# EAGLE design LED Controller (EAGLE 9.5.1)
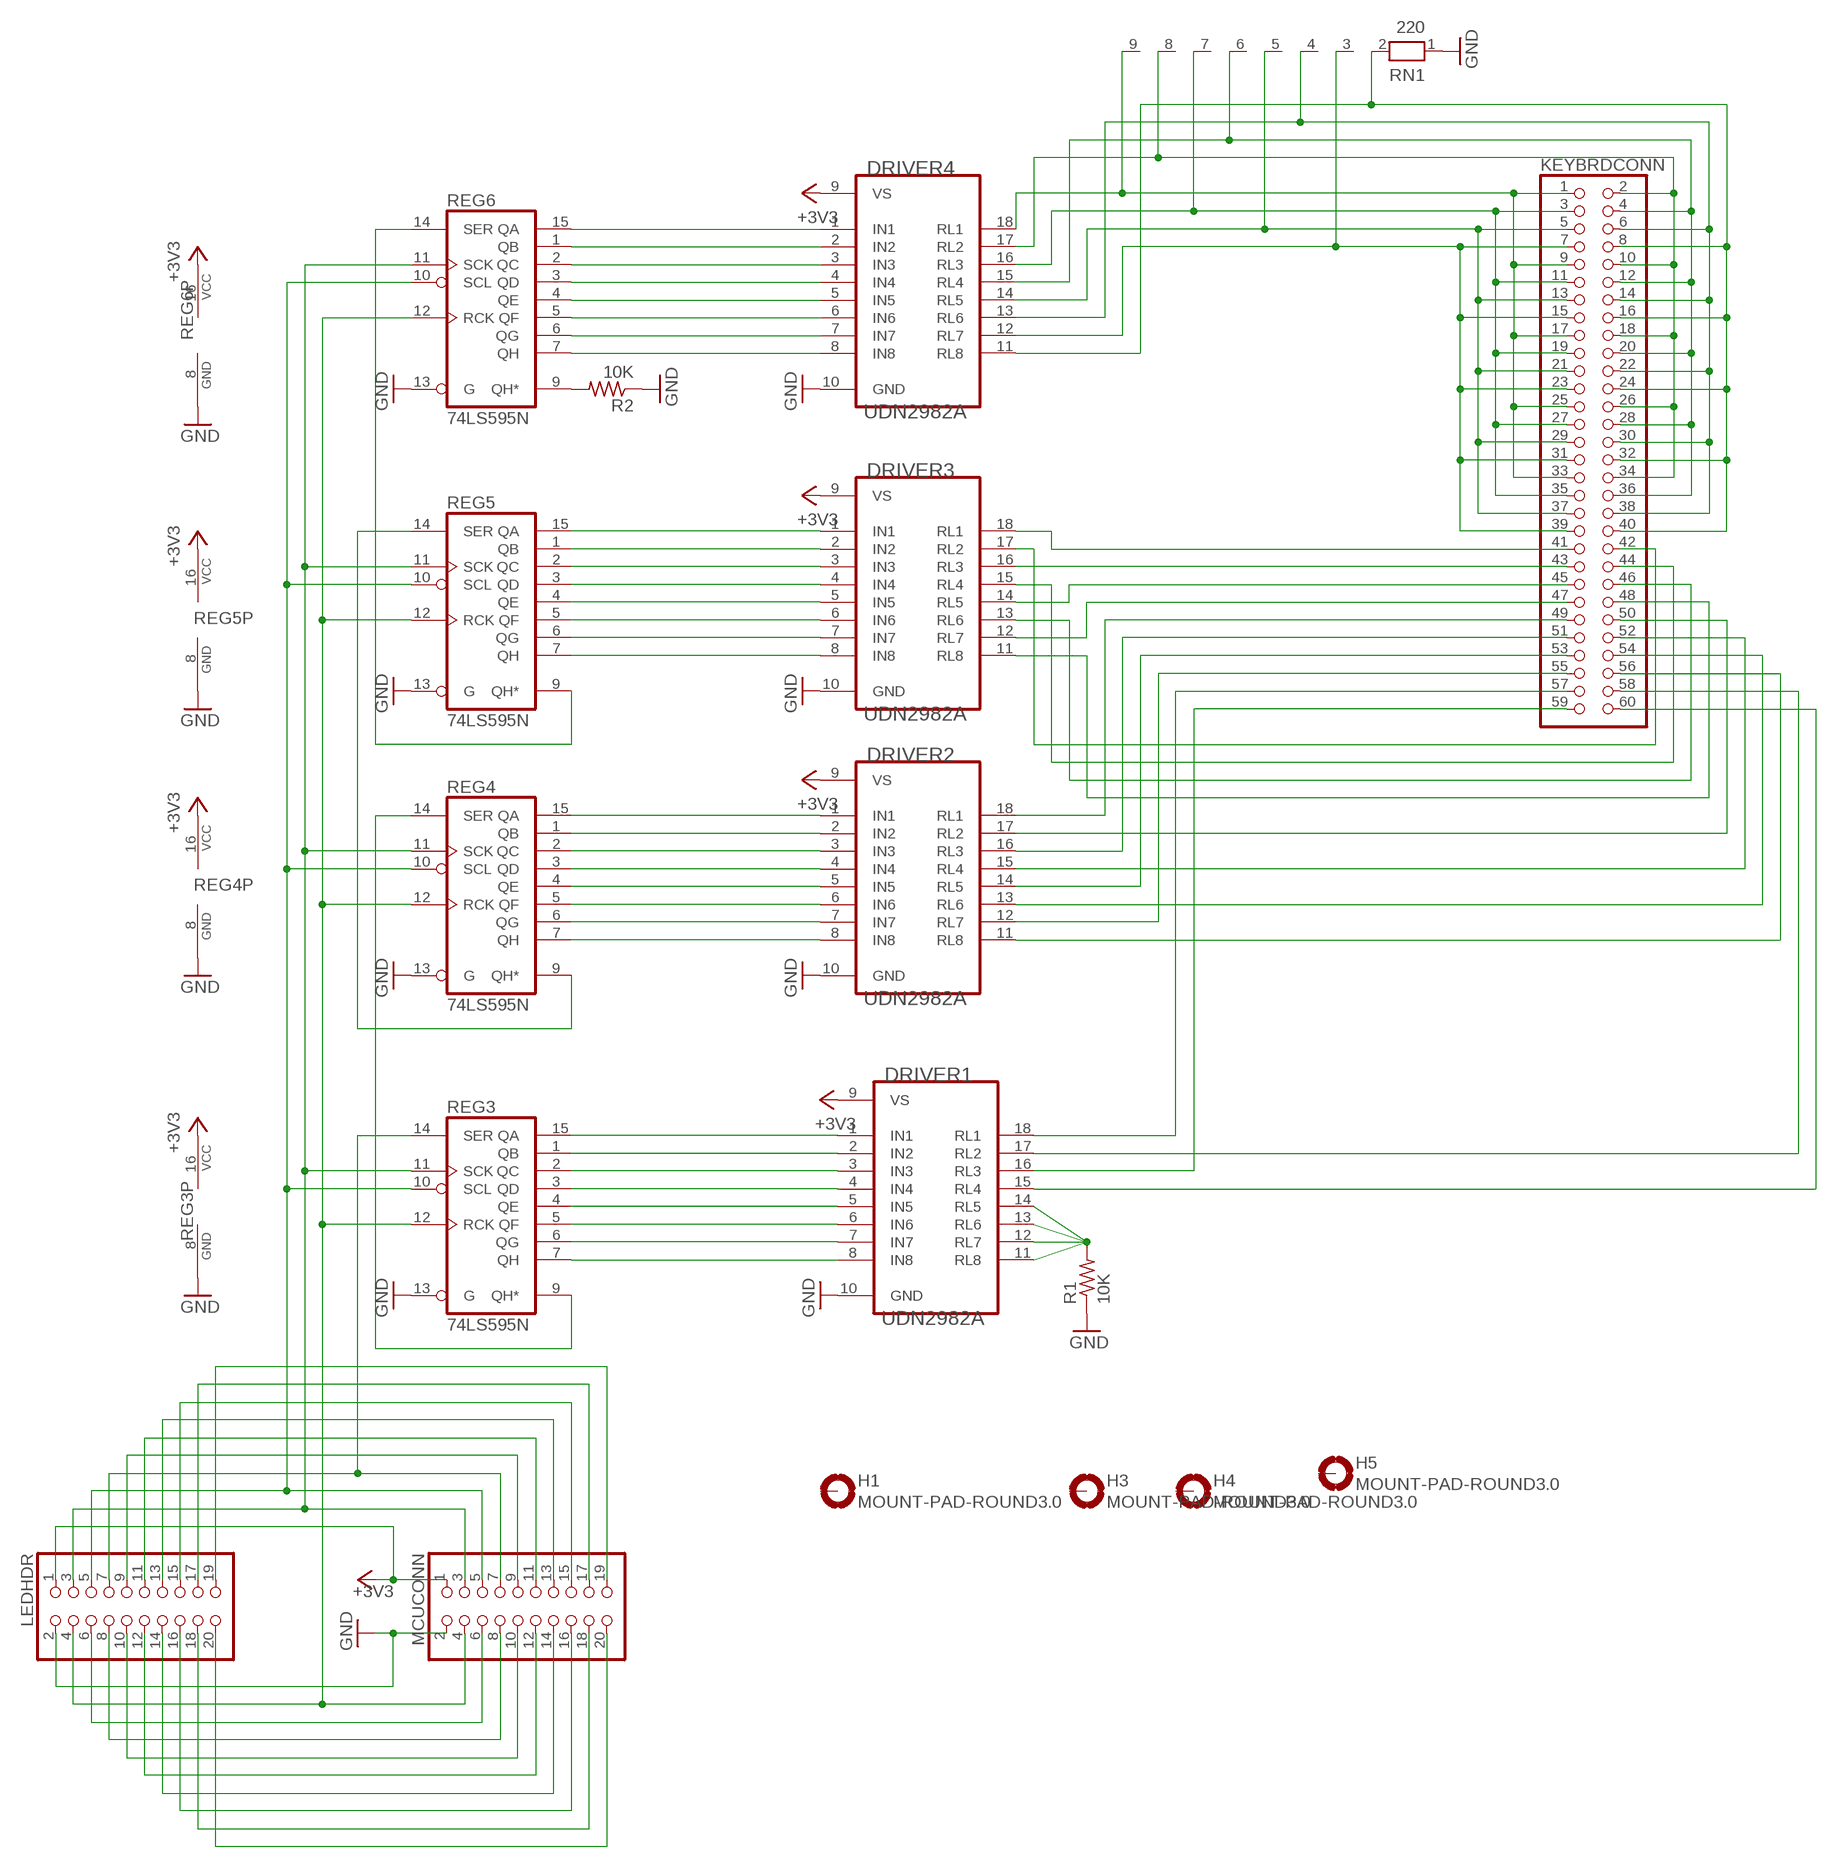
[diagram p0: schematic, sheet 1]

## Parts
DRIVER1  UDN2982A  [DIL18]
DRIVER2  UDN2982A  [DIL18]
DRIVER3  UDN2982A  [DIL18]
DRIVER4  UDN2982A  [DIL18]
H1  MOUNT-PAD-ROUND3.0  [3,0-PAD]
H3  MOUNT-PAD-ROUND3.0  [3,0-PAD]
H4  MOUNT-PAD-ROUND3.0  [3,0-PAD]
H5  MOUNT-PAD-ROUND3.0  [3,0-PAD]
KEYBRDCONN  PINHD-2X30/90  [2X30/90]
LEDHDR  PINHD-2X10  [2X10]
MCUCONN  PINHD-2X10  [2X10]
R1  10K  R-US_VMTA55  [VMTA55]
R2  10K  R-US_VMTA55  [VMTA55]
REG3  74LS595N  [DIL16]
REG4  74LS595N  [DIL16]
REG5  74LS595N  [DIL16]
REG6  74LS595N  [DIL16]
RN1  220  RN08  [RN-9]

## Nets
+3V3: DRIVER1.9(VS) DRIVER2.9(VS) DRIVER3.9(VS) DRIVER4.9(VS) LEDHDR.1 MCUCONN.1 REG3.16(VCC) REG4.16(VCC) REG5.16(VCC) REG6.16(VCC)
GND: DRIVER1.10(GND) DRIVER2.10(GND) DRIVER3.10(GND) DRIVER4.10(GND) R1.1 R2.1 REG3.8(GND) REG3.13(G) REG4.8(GND) REG4.13(G) REG5.8(GND) REG5.13(G) REG6.8(GND) REG6.13(G) RN1.1
INHD: LEDHDR.6 MCUCONN.6
N$1: DRIVER1.8(IN8) REG3.7(QH)
N$2: DRIVER4.2(IN2) REG6.1(QB)
N$3: DRIVER4.3(IN3) REG6.2(QC)
N$4: LEDHDR.8 MCUCONN.8
N$5: LEDHDR.10 MCUCONN.10
N$6: LEDHDR.12 MCUCONN.12
N$7: LEDHDR.14 MCUCONN.14
N$8: LEDHDR.16 MCUCONN.16
N$9: LEDHDR.18 MCUCONN.18
N$10: LEDHDR.20 MCUCONN.20
N$11: DRIVER4.4(IN4) REG6.3(QD)
N$12: DRIVER1.1(IN1) REG3.15(QA)
N$13: REG3.9(QH*) REG4.14(SER)
N$14: LEDHDR.9 MCUCONN.9
N$15: LEDHDR.11 MCUCONN.11
N$16: LEDHDR.13 MCUCONN.13
N$17: LEDHDR.15 MCUCONN.15
N$18: LEDHDR.17 MCUCONN.17
N$19: LEDHDR.19 MCUCONN.19
N$20: DRIVER4.11(RL8) KEYBRDCONN.8 KEYBRDCONN.16 KEYBRDCONN.24 KEYBRDCONN.32 KEYBRDCONN.40 RN1.2
N$21: DRIVER4.13(RL6) KEYBRDCONN.6 KEYBRDCONN.14 KEYBRDCONN.22 KEYBRDCONN.30 KEYBRDCONN.38 RN1.4
N$22: DRIVER4.15(RL4) KEYBRDCONN.4 KEYBRDCONN.12 KEYBRDCONN.20 KEYBRDCONN.28 KEYBRDCONN.36 RN1.6
N$23: DRIVER4.17(RL2) KEYBRDCONN.2 KEYBRDCONN.10 KEYBRDCONN.18 KEYBRDCONN.26 KEYBRDCONN.34 RN1.8
N$24: DRIVER1.2(IN2) REG3.1(QB)
N$25: DRIVER4.18(RL1) KEYBRDCONN.1 KEYBRDCONN.9 KEYBRDCONN.17 KEYBRDCONN.25 KEYBRDCONN.33 RN1.9
N$26: DRIVER1.3(IN3) REG3.2(QC)
N$27: DRIVER4.5(IN5) REG6.4(QE)
N$28: DRIVER4.6(IN6) REG6.5(QF)
N$29: DRIVER4.7(IN7) REG6.6(QG)
N$30: DRIVER1.4(IN4) REG3.3(QD)
N$31: DRIVER4.16(RL3) KEYBRDCONN.3 KEYBRDCONN.11 KEYBRDCONN.19 KEYBRDCONN.27 KEYBRDCONN.35 RN1.7
N$32: DRIVER4.14(RL5) KEYBRDCONN.5 KEYBRDCONN.13 KEYBRDCONN.21 KEYBRDCONN.29 KEYBRDCONN.37 RN1.5
N$33: DRIVER4.12(RL7) KEYBRDCONN.7 KEYBRDCONN.15 KEYBRDCONN.23 KEYBRDCONN.31 KEYBRDCONN.39 RN1.3
N$34: DRIVER1.5(IN5) REG3.4(QE)
N$35: DRIVER1.6(IN6) REG3.5(QF)
N$36: DRIVER1.7(IN7) REG3.6(QG)
N$37: REG4.9(QH*) REG5.14(SER)
N$38: REG5.9(QH*) REG6.14(SER)
N$39: DRIVER4.8(IN8) REG6.7(QH)
N$40: DRIVER4.1(IN1) REG6.15(QA)
N$41: R2.2 REG6.9(QH*)
N$42: DRIVER2.1(IN1) REG4.15(QA)
N$43: DRIVER2.2(IN2) REG4.1(QB)
N$44: DRIVER2.3(IN3) REG4.2(QC)
N$45: DRIVER2.4(IN4) REG4.3(QD)
N$46: DRIVER2.5(IN5) REG4.4(QE)
N$47: DRIVER2.6(IN6) REG4.5(QF)
N$48: DRIVER2.7(IN7) REG4.6(QG)
N$49: DRIVER2.8(IN8) REG4.7(QH)
N$50: DRIVER3.1(IN1) REG5.15(QA)
N$51: DRIVER3.2(IN2) REG5.1(QB)
N$52: DRIVER3.3(IN3) REG5.2(QC)
N$53: DRIVER3.4(IN4) REG5.3(QD)
N$54: DRIVER3.5(IN5) REG5.4(QE)
N$55: DRIVER3.6(IN6) REG5.5(QF)
N$56: DRIVER3.7(IN7) REG5.6(QG)
N$57: DRIVER3.8(IN8) REG5.7(QH)
N$58: DRIVER3.18(RL1) KEYBRDCONN.41
N$59: DRIVER3.16(RL3) KEYBRDCONN.43
N$60: DRIVER3.14(RL5) KEYBRDCONN.45
N$61: DRIVER3.12(RL7) KEYBRDCONN.47
N$62: DRIVER3.17(RL2) KEYBRDCONN.42
N$63: DRIVER3.15(RL4) KEYBRDCONN.44
N$64: DRIVER3.13(RL6) KEYBRDCONN.46
N$65: DRIVER3.11(RL8) KEYBRDCONN.48
N$66: DRIVER2.18(RL1) KEYBRDCONN.49
N$67: DRIVER2.16(RL3) KEYBRDCONN.51
N$68: DRIVER2.14(RL5) KEYBRDCONN.53
N$69: DRIVER1.18(RL1) KEYBRDCONN.57
N$70: DRIVER2.12(RL7) KEYBRDCONN.55
N$71: DRIVER2.17(RL2) KEYBRDCONN.50
N$72: DRIVER2.15(RL4) KEYBRDCONN.52
N$73: DRIVER2.13(RL6) KEYBRDCONN.54
N$74: DRIVER2.11(RL8) KEYBRDCONN.56
N$75: DRIVER1.16(RL3) KEYBRDCONN.59
N$76: DRIVER1.17(RL2) KEYBRDCONN.58
N$77: DRIVER1.15(RL4) KEYBRDCONN.60
N$81: DRIVER1.11(RL8) DRIVER1.12(RL7) DRIVER1.13(RL6) DRIVER1.14(RL5) R1.2
RCK: LEDHDR.4 MCUCONN.4 REG3.12(RCK) REG4.12(RCK) REG5.12(RCK) REG6.12(RCK)
REG3: LEDHDR.2 MCUCONN.2 ; supply symbol labelled GND
REG3DATA: LEDHDR.7 MCUCONN.7 REG3.14(SER)
SCK: LEDHDR.3 MCUCONN.3 REG3.11(SCK) REG4.11(SCK) REG5.11(SCK) REG6.11(SCK)
SCL: LEDHDR.5 MCUCONN.5 REG3.10(SCL) REG4.10(SCL) REG5.10(SCL) REG6.10(SCL)
Unconnected: H1.B3,0(MOUNT) H3.B3,0(MOUNT) H4.B3,0(MOUNT) H5.B3,0(MOUNT)

## Library data of the parts
DRIVER1-DRIVER4 = UDN2982A:UDN2982A
H1 H3-H5 = holes:MOUNT-PAD-ROUND: MOUNTING PAD, round
KEYBRDCONN = pinhead:PINHD-2X30: PIN HEADER
LEDHDR MCUCONN = pinhead:PINHD-2X10: PIN HEADER
R1 R2 = resistor:R-US_: RESISTOR, American symbol
REG3-REG6 = 74xx-us:74*595: 8-bit SHIFT REGISTER, output latch
RN1 = resistor-net:RN08: RESISTOR NETWORK; OC_FARNELL: unknown; OC_NEWARK: unknown

## Board
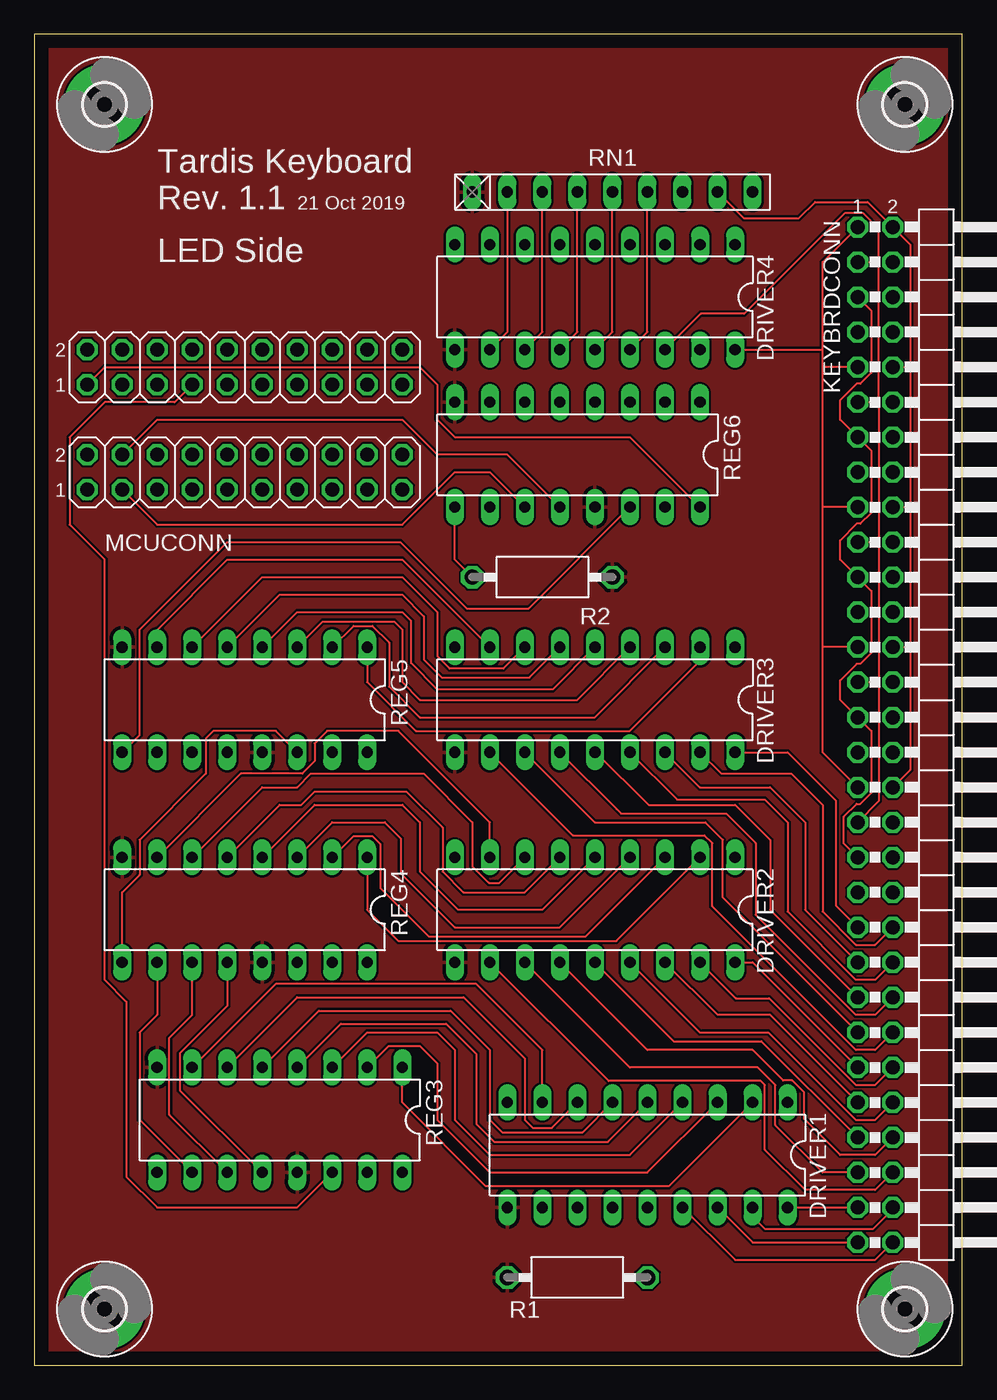
[diagram p1: board, top side]
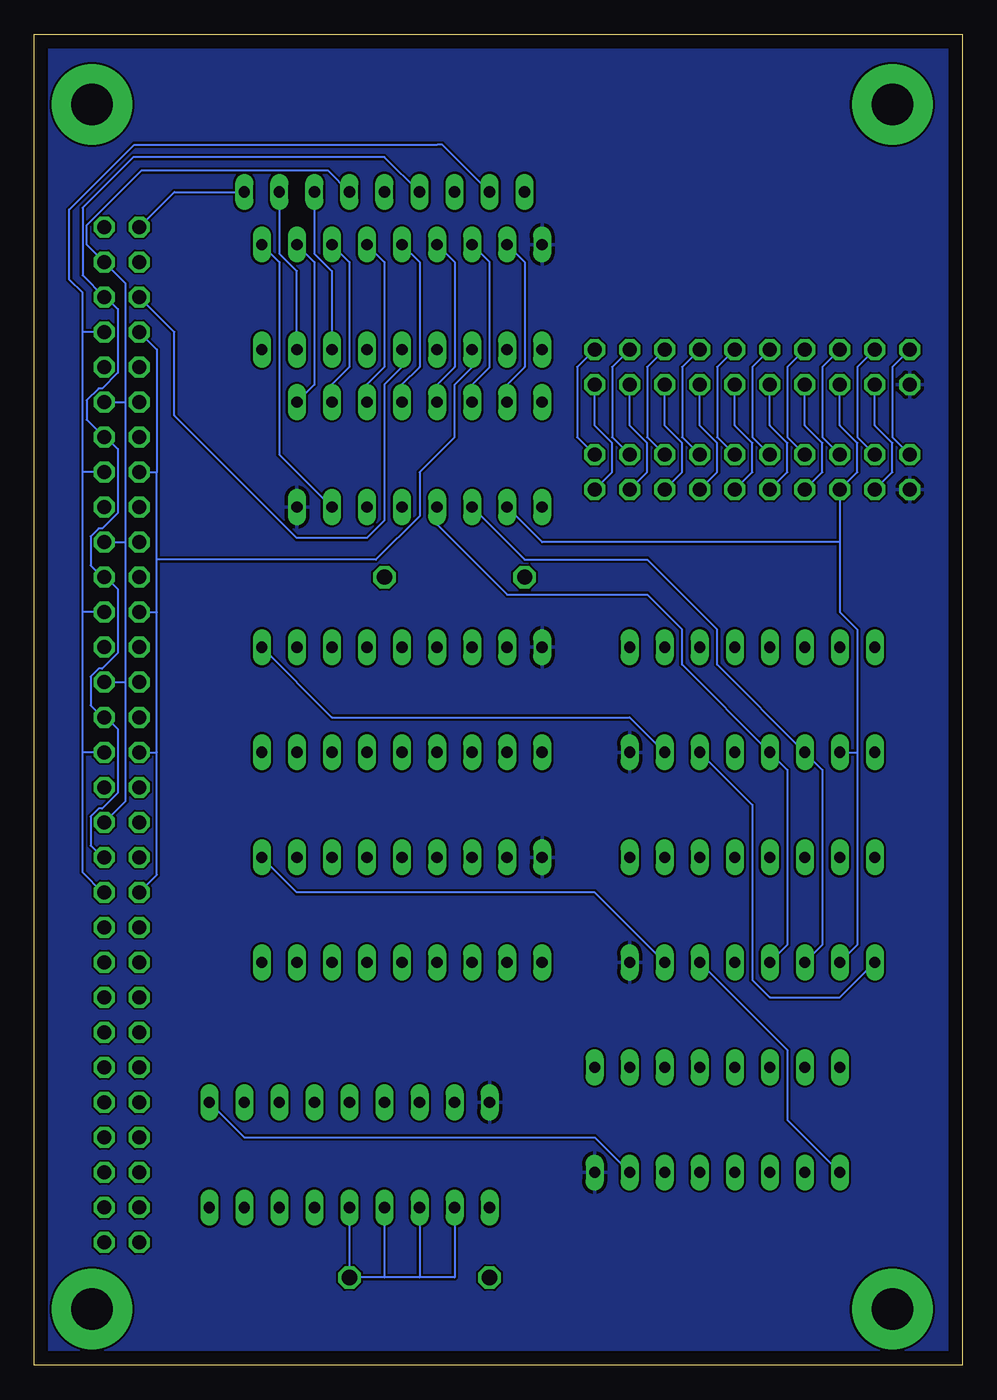
[diagram p2: board, bottom side, seen from below]

Size 67.29 x 96.52 mm. Coordinates in mm from the lower left corner, seen from the top.
Outline: 0,0 67.29,0 67.29,96.52 0,96.52 0,0
Copper layers (1*16): Top 0.035mm / dielectric 1.5mm / Bottom 0.035mm
Design rules "default": minimum track width 6mil, minimum drill 0.35mm, track to track 6mil, track to pad 6mil, pad to pad 6mil, via to via 6mil, smd to smd 6mil, copper to edge 40mil, drill to drill 6mil, minimum pad ring 10mil, minimum via ring 8mil, stop-mask expansion 4mil, vias tented up to drill 0mil, thermal gap 10mil

### Footprints (pad centres in the part's own frame; a part is rotated, then mirrored left to right if it is on the bottom)
DIL18 = drill 0.813 long: 1 -10.16,-3.81; 2 -7.62,-3.81; 3 -5.08,-3.81; 4 -2.54,-3.81; 5 0,-3.81; 6 2.54,-3.81; 7 5.08,-3.81; 8 7.62,-3.81; 9 10.16,-3.81; 10 10.16,3.81; 11 7.62,3.81; 12 5.08,3.81; 13 2.54,3.81; 14 0,3.81; 15 -2.54,3.81; 16 -5.08,3.81; 17 -7.62,3.81; 18 -10.16,3.81
3,0-PAD = drill 3 pad 5.842: B3,0 0,0
2X30/90 = drill 1.016 octagon: 1 -36.83,-6.35; 2 -36.83,-3.81; 3 -34.29,-6.35; 4 -34.29,-3.81; 5 -31.75,-6.35; 6 -31.75,-3.81; 7 -29.21,-6.35; 8 -29.21,-3.81; 9 -26.67,-6.35; 10 -26.67,-3.81; 11 -24.13,-6.35; 12 -24.13,-3.81; 13 -21.59,-6.35; 14 -21.59,-3.81; 15 -19.05,-6.35; 16 -19.05,-3.81; 17 -16.51,-6.35; 18 -16.51,-3.81; 19 -13.97,-6.35; 20 -13.97,-3.81; 21 -11.43,-6.35; 22 -11.43,-3.81; 23 -8.89,-6.35; 24 -8.89,-3.81; 25 -6.35,-6.35; 26 -6.35,-3.81; 27 -3.81,-6.35; 28 -3.81,-3.81; 29 -1.27,-6.35; 30 -1.27,-3.81; 31 1.27,-6.35; 32 1.27,-3.81; 33 3.81,-6.35; 34 3.81,-3.81; 35 6.35,-6.35; 36 6.35,-3.81; 37 8.89,-6.35; 38 8.89,-3.81; 39 11.43,-6.35; 40 11.43,-3.81; 41 13.97,-6.35; 42 13.97,-3.81; 43 16.51,-6.35; 44 16.51,-3.81; 45 19.05,-6.35; 46 19.05,-3.81; 47 21.59,-6.35; 48 21.59,-3.81; 49 24.13,-6.35; 50 24.13,-3.81; 51 26.67,-6.35; 52 26.67,-3.81; 53 29.21,-6.35; 54 29.21,-3.81; 55 31.75,-6.35; 56 31.75,-3.81; 57 34.29,-6.35; 58 34.29,-3.81; 59 36.83,-6.35; 60 36.83,-3.81
2X10 = drill 1.016 octagon: 1 -11.43,-1.27; 2 -11.43,1.27; 3 -8.89,-1.27; 4 -8.89,1.27; 5 -6.35,-1.27; 6 -6.35,1.27; 7 -3.81,-1.27; 8 -3.81,1.27; 9 -1.27,-1.27; 10 -1.27,1.27; 11 1.27,-1.27; 12 1.27,1.27; 13 3.81,-1.27; 14 3.81,1.27; 15 6.35,-1.27; 16 6.35,1.27; 17 8.89,-1.27; 18 8.89,1.27; 19 11.43,-1.27; 20 11.43,1.27
VMTA55 = drill 1.1 octagon: 1 -5.08,0; 2 5.08,0
DIL16 = drill 0.813 long: 1 -8.89,-3.81; 2 -6.35,-3.81; 3 -3.81,-3.81; 4 -1.27,-3.81; 5 1.27,-3.81; 6 3.81,-3.81; 7 6.35,-3.81; 8 8.89,-3.81; 9 8.89,3.81; 10 6.35,3.81; 11 3.81,3.81; 12 1.27,3.81; 13 -1.27,3.81; 14 -3.81,3.81; 15 -6.35,3.81; 16 -8.89,3.81
RN-9 = drill 0.813 long: 1 -10.16,0; 2 -7.62,0; 3 -5.08,0; 4 -2.54,0; 5 0,0; 6 2.54,0; 7 5.08,0; 8 7.62,0; 9 10.16,0

### Placement (x,y rotation side)
DRIVER1  44.45,15.24 180 top
DRIVER2  40.64,33.02 180 top
DRIVER3  40.64,48.26 180 top
DRIVER4  40.64,77.47 180 top
H1  63.12,4.06 0 top
H3  63.12,91.44 0 top
H4  5.08,4.06 0 top
H5  5.08,91.44 0 top
KEYBRDCONN  66.04,45.72 270 top
LEDHDR  15.24,72.39 0 top
MCUCONN  15.24,64.77 0 top
R1  39.37,6.35 0 top
R2  36.83,57.15 180 top
REG3  17.78,17.78 180 top
REG4  15.24,33.02 180 top
REG5  15.24,48.26 180 top
REG6  39.37,66.04 180 top
RN1  41.91,85.09 0 top

### Tracks (layer width: path | path; a pad name or v marks a point on that pad's centre or on a via)
+3V3
  Top 0.152: LEDHDR.1 5.08,72.39 27.94,72.39 29.21,71.12 29.21,68.58 30.48,67.31 43.18,67.31 REG6.16
  pour Bottom: 0,96.52 67.31,96.52 67.31,0 0,0
GND
  pour Top: 0,96.52 67.31,96.52 67.31,0 0,0
INHD
  Bottom 0.152: LEDHDR.6 10.16,72.39 10.16,67.31 MCUCONN.6
N$1
  Top 0.152: REG3.7 17.5,27.66 32.03,27.66 36.83,22.86 DRIVER1.8
N$2
  Bottom 0.152: DRIVER4.2 46.99,80.01 46.99,71.12 REG6.1
N$3
  Bottom 0.152: DRIVER4.3 44.45,80.01 44.45,72.39 45.72,71.12 REG6.2
N$4
  Bottom 0.152: LEDHDR.8 12.7,72.39 12.7,67.31 MCUCONN.8
N$5
  Bottom 0.152: LEDHDR.10 15.24,72.39 15.24,67.31 MCUCONN.10
N$6
  Bottom 0.152: LEDHDR.12 17.78,72.39 17.78,67.31 MCUCONN.12
N$7
  Bottom 0.152: LEDHDR.14 20.32,72.39 20.32,67.31 MCUCONN.14
N$8
  Bottom 0.152: LEDHDR.16 22.86,72.39 22.86,67.31 MCUCONN.16
N$9
  Bottom 0.152: LEDHDR.18 25.4,72.39 25.4,67.31 MCUCONN.18
N$10
  Bottom 0.152: LEDHDR.20 27.94,72.39 27.94,67.31 MCUCONN.20
N$11
  Bottom 0.152: DRIVER4.4 41.91,80.01 41.91,72.39 43.18,71.12 REG6.3
N$12
  Bottom 0.152: REG3.15 26.67,16.51 52.07,16.51 DRIVER1.1
N$13
  Bottom 0.152: REG3.9 12.7,17.78 12.7,22.86 REG4.14
N$14
  Bottom 0.152: MCUCONN.9 12.7,64.77 12.7,66.88 13.97,68.15 LEDHDR.9
N$15
  Bottom 0.152: MCUCONN.11 15.24,64.77 15.24,66.88 16.51,68.15 LEDHDR.11
N$16
  Bottom 0.152: MCUCONN.13 17.78,64.77 17.78,66.88 19.05,68.15 LEDHDR.13
N$17
  Bottom 0.152: MCUCONN.15 20.32,64.77 20.32,66.88 21.59,68.15 LEDHDR.15
N$18
  Bottom 0.152: MCUCONN.17 22.86,64.77 22.86,66.88 24.13,68.15 LEDHDR.17
N$19
  Bottom 0.152: MCUCONN.19 25.4,64.77 25.4,66.88 26.67,68.15 LEDHDR.19
N$20
  Top 0.152: DRIVER4.11 34.29,74.93 RN1.2
  Bottom 0.152: KEYBRDCONN.40 62.36,34.29 63.81,35.73 63.81,44.45 | 63.81,44.45 63.81,54.61 | 63.81,54.61 63.81,64.77 | 63.81,64.77 63.81,74.93 | KEYBRDCONN.16 63.81,64.77 | KEYBRDCONN.24 63.81,54.61 | KEYBRDCONN.32 63.81,44.45 | KEYBRDCONN.8 63.81,74.93 | 63.81,74.93 63.81,77.77 64.77,78.74 64.77,83.82 60.07,88.52 38.1,88.52 37.72,88.52 RN1.2
N$21
  Top 0.152: DRIVER4.13 39.37,74.93 RN1.4
  Bottom 0.152: KEYBRDCONN.38 62.36,36.83 63.22,37.69 63.22,39.78 62.64,40.36 62.38,40.36 61.24,41.5 61.24,46.13 62.1,46.99 KEYBRDCONN.30 62.36,46.99 63.22,47.85 63.22,49.94 62.64,50.52 62.38,50.52 61.24,51.66 61.24,56.29 62.1,57.15 KEYBRDCONN.22 62.36,57.15 63.22,58.01 63.22,60.1 62.64,60.68 62.38,60.68 61.24,61.82 61.24,66.45 62.1,67.31 KEYBRDCONN.14 63.5,68.58 63.5,69.98 62.64,70.84 62.38,70.84 61.24,71.98 61.24,76.61 62.1,77.47 KEYBRDCONN.6 63.81,79.04 63.81,83.95 60.12,87.63 41.91,87.63 RN1.4
N$22
  Top 0.152: DRIVER4.15 44.45,74.93 RN1.6
  Bottom 0.152: 60.68,69.85 60.68,78.46 KEYBRDCONN.4 63.5,81.28 63.5,82.68 59.54,86.64 46,86.64 RN1.6 | KEYBRDCONN.36 60.68,40.92 60.68,49.53 | 60.68,49.53 60.68,59.69 | 60.68,59.69 60.68,69.85 | KEYBRDCONN.28 60.68,49.53 | KEYBRDCONN.20 60.68,59.69 | KEYBRDCONN.12 60.68,69.85
N$23
  Top 0.152: 63.5,72.39 63.5,81.28 KEYBRDCONN.2 60.41,84.37 56.6,84.37 55.41,83.18 51.44,83.18 RN1.8 | 63.5,72.39 63.5,62.23 | 63.5,62.23 63.5,52.07 | 63.5,52.07 63.5,43.18 KEYBRDCONN.34 | KEYBRDCONN.26 63.5,52.07 | KEYBRDCONN.18 63.5,62.23 | KEYBRDCONN.10 63.5,72.39
  Bottom 0.152: DRIVER4.17 48.26,79.36 49.53,80.63 RN1.8
N$24
  Top 0.152: DRIVER1.2 46,12.98 32.74,12.98 26.67,19.05 REG3.1
N$25
  Top 0.152: 57.15,52.07 57.15,44.45 KEYBRDCONN.33 | KEYBRDCONN.25 57.15,52.07 | KEYBRDCONN.17 57.15,62.23 | KEYBRDCONN.1 57.15,80.01 57.15,73.66 | 57.15,62.23 57.15,72.39 | 57.15,72.39 57.15,73.66 | DRIVER4.18 57.15,73.66 | KEYBRDCONN.9 57.15,72.39 | 57.15,52.07 57.15,62.23
  Bottom 0.152: KEYBRDCONN.1 57.15,85.09 RN1.9
N$26
  Top 0.152: REG3.2 25.68,23.14 27.94,23.14 29.21,21.87 29.21,17.78 33.02,13.97 44.45,13.97 DRIVER1.3
N$27
  Bottom 0.152: DRIVER4.5 39.37,80.01 39.37,72.39 40.64,71.12 REG6.4
N$28
  Bottom 0.152: DRIVER4.6 36.83,80.01 36.83,72.39 38.1,71.12 REG6.5
N$29
  Bottom 0.152: DRIVER4.7 34.29,80.01 34.29,72.39 35.56,71.12 REG6.6
N$30
  Top 0.152: DRIVER1.4 43.18,15.24 33.02,15.24 30.48,17.78 30.48,22.86 29.21,24.13 24.13,24.13 REG3.3
N$31
  Top 0.152: 61.24,69.85 61.24,80.01 | 61.24,69.85 61.24,59.69 | 61.24,59.69 61.24,49.53 | 61.24,49.53 61.24,40.92 KEYBRDCONN.35 | KEYBRDCONN.27 61.24,49.53 | KEYBRDCONN.19 61.24,59.69 | KEYBRDCONN.11 61.24,69.85 | 61.24,80.01 61.24,82.4 60.1,83.54 58.74,83.54 51.46,76.26 48.32,76.26 DRIVER4.16 | KEYBRDCONN.3 61.24,80.01
  Bottom 0.152: DRIVER4.16 45.72,79.36 46.99,80.63 RN1.7
N$32
  Top 0.152: DRIVER4.14 41.91,74.93 RN1.5 | KEYBRDCONN.37 58.7,37.82 58.7,39.78 59.62,40.7 59.89,40.7 60.68,41.5 60.68,46 KEYBRDCONN.29 58.42,48.26 58.42,49.66 59.62,50.87 59.89,50.87 60.68,51.66 60.68,56.16 KEYBRDCONN.21 58.42,58.42 58.42,59.82 59.62,61.02 59.89,61.02 60.68,61.82 60.68,66.32 KEYBRDCONN.13 58.42,68.58 58.42,69.98 59.62,71.18 59.89,71.18 60.68,71.98 60.68,76.48 KEYBRDCONN.5
  Bottom 0.152: KEYBRDCONN.5 57.15,74.93 57.15,68.88 48.26,59.99 43.18,59.99 41.91,61.27 41.91,71.12 40.64,72.39 DRIVER4.14
N$33
  Top 0.152: DRIVER4.12 36.83,74.93 RN1.3
  Bottom 0.152: KEYBRDCONN.7 58.42,73.66 58.42,64.77 | 58.42,54.61 58.42,58.42 | 58.42,58.42 58.42,64.77 | KEYBRDCONN.15 58.42,64.77 | KEYBRDCONN.39 58.42,35.56 58.42,44.45 | 58.42,44.45 58.42,54.61 | KEYBRDCONN.23 58.42,54.61 | KEYBRDCONN.31 58.42,44.45 | DRIVER4.12 35.56,72.39 36.83,71.12 36.83,67.31 39.37,64.77 39.37,61.58 42.53,58.42 58.42,58.42
N$34
  Top 0.152: DRIVER1.5 41.57,16.18 33.36,16.18 32.05,17.48 32.05,22.56 29.84,24.77 22.23,24.77 REG3.4
N$35
  Top 0.152: DRIVER1.6 39.75,16.89 33.91,16.89 33.02,17.78 33.02,22.86 30.17,25.71 20.62,25.71 REG3.5
N$36
  Top 0.152: DRIVER1.7 37.52,17.2 36.14,17.2 35.56,17.78 35.56,22.24 31.13,26.67 19.05,26.67 REG3.6
N$37
  Top 0.152: REG4.9 6.35,34.29 7.62,35.56 7.62,38.1 12.42,42.9 12.42,45.44 12.98,46 17.5,46 REG5.14
  Bottom 0.152: REG5.14 15.24,40.64 15.24,27.94 13.97,26.67 8.89,26.67 REG4.9
N$38
  Top 0.152: REG5.9 7.62,45.72 7.62,53.34 13.97,59.69 26.54,59.69 31.34,54.89 35.84,54.89 REG6.14
N$39
  Bottom 0.152: DRIVER4.8 31.75,80.01 31.75,72.39 33.02,71.12 REG6.7
N$40
  Bottom 0.152: DRIVER4.1 49.53,80.01 49.53,66.04 REG6.15
N$41
  Top 0.152: R2.2 30.48,58.42 REG6.9
N$42
  Bottom 0.152: REG4.15 26.67,34.29 48.26,34.29 DRIVER2.1
N$43
  Top 0.152: DRIVER2.2 42.19,30.76 26.39,30.76 24.13,33.02 REG4.1
N$44
  Top 0.152: DRIVER2.3 39.95,31.06 28.63,31.06 25.09,34.6 25.09,37.79 24.5,38.38 23.14,38.38 REG4.2
N$45
  Top 0.152: DRIVER2.4 38.1,31.75 30.48,31.75 26.57,35.66 26.57,38.2 25.4,39.37 21.59,39.37 REG4.3
N$46
  Top 0.152: DRIVER2.5 36.83,33.02 30.72,33.02 27.94,35.8 27.94,39.37 26.67,40.64 20.32,40.64 REG4.4
N$47
  Top 0.152: REG4.5 17.78,40.64 19.36,40.64 20.32,41.61 26.98,41.61 29.59,38.99 29.59,35.8 31.1,34.29 35.56,34.29 DRIVER2.6
N$48
  Top 0.152: DRIVER2.7 33.71,34.98 32.96,34.98 31.75,36.18 31.75,39.37 28.22,42.9 20.04,42.9 19.05,41.91 16.51,41.91 REG4.6
N$49
  Top 0.152: DRIVER2.8 33.02,39.37 26.39,46 21.22,46 20.32,45.1 20.32,43.8 19.42,42.9 14.96,42.9 REG4.7
N$50
  Bottom 0.152: REG5.15 24.13,46.99 45.72,46.99 DRIVER3.1
N$51
  Top 0.152: REG5.1 24.13,49.53 27.66,46 43.18,46 48.26,51.08 DRIVER3.2
N$52
  Top 0.152: REG5.2 23.14,53.62 24.5,53.62 25.72,52.39 25.72,49.21 27.94,46.99 40.64,46.99 DRIVER3.3
N$53
  Top 0.152: REG5.3 20.9,53.92 26.09,53.92 26.67,53.34 26.67,49.53 27.94,48.26 39.37,48.26 DRIVER3.4
N$54
  Top 0.152: DRIVER3.5 37.59,49.02 29.21,49.02 27.31,50.92 27.31,53.98 26.67,54.61 19.05,54.61 REG5.4
N$55
  Top 0.152: DRIVER3.6 35.89,49.87 29.55,49.87 28.25,51.17 28.25,54.3 26.67,55.88 17.78,55.88 REG5.5
N$56
  Top 0.152: DRIVER3.7 34.01,50.52 30.11,50.52 29.21,51.42 29.21,54.61 26.67,57.15 16.51,57.15 REG5.6
N$57
  Top 0.152: REG5.7 8.89,53.31 14,58.42 26.67,58.42 DRIVER3.8
N$58
  Top 0.152: KEYBRDCONN.41 58.12,33.33 58.12,40.95 54.61,44.45 DRIVER3.18
N$59
  Top 0.152: KEYBRDCONN.43 55.88,33.02 55.88,39.37 53.34,41.91 48.26,41.91 DRIVER3.16
N$60
  Top 0.152: KEYBRDCONN.45 53.34,33.02 53.34,38.1 50.8,40.64 44.53,40.64 40.72,44.45 DRIVER3.14
N$61
  Top 0.152: KEYBRDCONN.47 49.91,33.91 49.91,38.1 48.64,39.37 40.64,39.37 DRIVER3.12
N$62
  Top 0.152: KEYBRDCONN.42 60.96,30.48 59.56,30.48 57.15,32.89 57.15,40.64 54.89,42.9 49.81,42.9 DRIVER3.17
N$63
  Top 0.152: KEYBRDCONN.44 60.96,27.94 59.56,27.94 54.61,32.89 54.61,39.37 52.96,41.02 46.61,41.02 DRIVER3.15
N$64
  Top 0.152: KEYBRDCONN.46 60.96,25.4 59.56,25.4 52.3,32.66 52.3,37.87 50.16,40.01 42.55,40.01 42.22,40.34 DRIVER3.13
N$65
  Top 0.152: KEYBRDCONN.48 60.96,22.86 59.56,22.86 49.15,33.27 49.15,37.86 48.58,38.42 39.05,38.42 DRIVER3.11
N$66
  Top 0.152: DRIVER2.18 52.07,29.21 KEYBRDCONN.49
N$67
  Top 0.152: DRIVER2.16 49.53,25.4 53.34,25.4 KEYBRDCONN.51
N$68
  Top 0.152: KEYBRDCONN.53 52.71,23.5 46.35,23.5 DRIVER2.14
N$69
  Top 0.152: DRIVER1.18 KEYBRDCONN.57
N$70
  Top 0.152: DRIVER2.12 43.18,21.59 52.45,21.59 53.72,20.32 53.72,17.4 57.15,13.97 KEYBRDCONN.55
N$71
  Top 0.152: KEYBRDCONN.50 60.96,20.32 59.56,20.32 53.28,26.61 50.87,26.61 DRIVER2.17
N$72
  Top 0.152: KEYBRDCONN.52 60.96,17.78 59.56,17.78 53.21,24.13 48.26,24.13 DRIVER2.15
N$73
  Top 0.152: DRIVER2.13 44.45,22.86 52.07,22.86 54.29,20.64 54.93,20.64 55.81,19.76 55.81,17.85 58.42,15.24 60.96,15.24 KEYBRDCONN.54
N$74
  Top 0.152: DRIVER2.11 41.63,20.6 52.68,20.6 52.96,20.32 52.96,15.62 55.88,12.7 60.96,12.7 KEYBRDCONN.56
N$75
  Top 0.152: DRIVER1.16 52.07,8.89 KEYBRDCONN.59
N$76
  Top 0.152: DRIVER1.17 52.07,10.78 52.97,9.88 60.81,9.88 62.23,11.3 KEYBRDCONN.58
N$77
  Top 0.152: DRIVER1.15 50.8,7.62 60.96,7.62 KEYBRDCONN.60
N$81
  Bottom 0.152: DRIVER1.11 36.83,6.35 39.37,6.35 | 39.37,6.35 41.91,6.35 | 41.91,6.35 R1.2 DRIVER1.14 | DRIVER1.12 39.37,6.35 | DRIVER1.13 41.91,6.35
RCK
  Top 0.152: REG4.12 13.97,26.05 10.54,22.62 10.54,19.94 REG3.12 | MCUCONN.4 8.89,68.58 26.67,68.58 29.21,66.04 34.29,66.04 REG6.12
  Bottom 0.152: LEDHDR.4 7.62,72.39 7.62,67.31 MCUCONN.4 | REG6.12 38.1,60.96 33.02,55.88 22.86,55.88 20.32,53.34 20.32,50.8 REG5.12 12.7,43.18 12.7,30.48 REG4.12
REG3
  Bottom 0.152: LEDHDR.2 5.08,72.39 5.08,67.31 MCUCONN.2
REG3DATA
  Top 0.152: LEDHDR.7 10.16,69.85 5.08,69.85 2.54,67.31 2.54,60.96 5.08,58.42 5.08,27.94 6.66,26.36 6.66,13.66 8.89,11.43 19.05,11.43 REG3.14
  Bottom 0.152: MCUCONN.7 10.16,64.77 10.16,66.88 11.43,68.15 LEDHDR.7
SCK
  Top 0.152: REG4.11 11.43,25.4 9.78,23.75 9.78,18.16 REG3.11 | MCUCONN.3 8.89,60.96 26.67,60.96 30.48,64.77 33.02,64.77 REG6.11
  Bottom 0.152: MCUCONN.3 5.08,64.77 5.08,66.88 6.35,68.15 LEDHDR.3 | REG4.11 10.16,30.48 10.16,43.18 REG5.11 17.78,50.8 17.78,53.34 22.86,58.42 31.75,58.42 REG6.11
SCL
  Top 0.152: REG4.10 8.89,25.4 7.62,24.13 7.62,17.78 REG3.10
  Bottom 0.152: LEDHDR.5 8.89,68.15 7.62,66.88 7.62,64.77 MCUCONN.5 8.89,59.69 | REG6.10 30.48,59.69 8.89,59.69 | REG4.10 7.62,30.48 7.62,44.45 | 8.89,59.69 8.89,54.61 7.62,53.34 7.62,44.45 | REG5.10 7.62,44.45

### Text on the board
tNames: Tardis Keyboard / Rev. 1.1 | 21 Oct 2019 | 1 | 2 | LED Side | 2 | 1 | 2 | 1
tValues: GND | RCK | INHD | 8 | 10 | 12 | 14 | 16 | 18 | 20 | +3V3 | SCK | SCL | COM | 9 | 11 | 13 | 15 | 17 | 19 | GND | RCK | INHD | 8 | 10 | 12 | 14 | 16 | 18 | 20 | +3V3 | SCK | SCL | COM | 9 | 11 | 13 | 15 | 17 | 19